# Altium schematic sheet MCU.SchDoc: MCU
size A3; Organization: ORGANIZATION; Address1: ADDRESS 1; Address2: ADDRESS 2; Address3: ADDRESS 3; Address4: ADDRESS 4; Revision: 0.0; SheetNumber: 4; SheetTotal: 19; ENG_APP_DATE: --/--/--; DSN_APP_DATE: --/--/--; CHK_APP_DATE: --/--/--
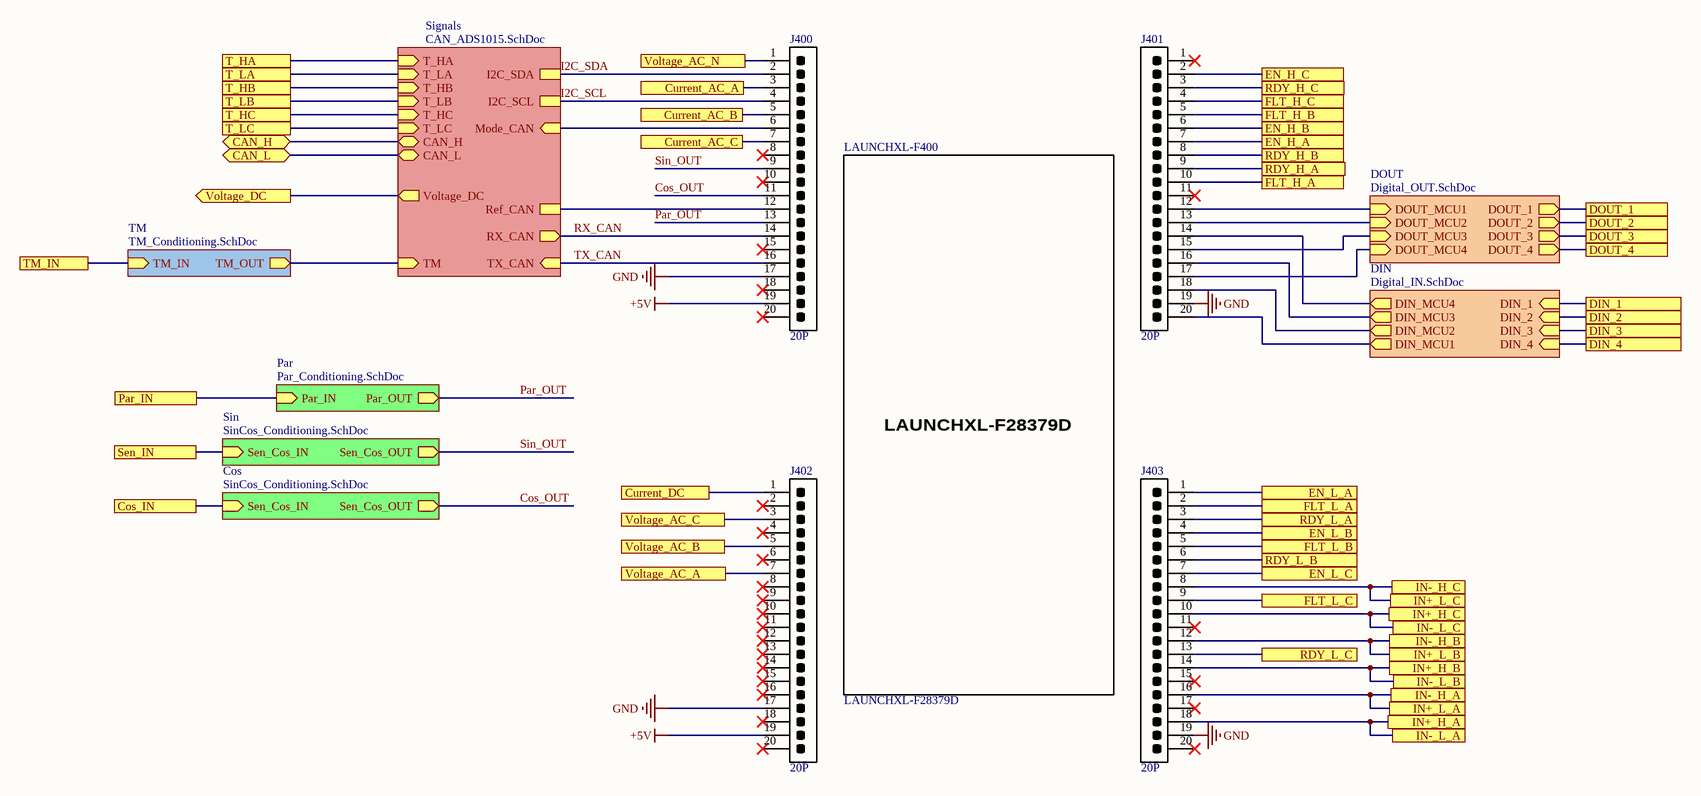
[diagram p0: MCU.SchDoc]

## Parts
J400  value 20P  [PIN_HEADER_THT_20P]  (hidden comment: CONN 20P)
J401  value 20P  [PIN_HEADER_THT_20P]  (hidden comment: CONN 20P)
J402  value 20P  [PIN_HEADER_THT_20P]  (hidden comment: CONN 20P)
J403  value 20P  [PIN_HEADER_THT_20P]  (hidden comment: CONN 20P)
LAUNCHXL-F400  LAUNCHXL-F28379D  [LAUNCHXL-F28379D]

## Sub-sheets
Cos = SinCos_Conditioning.SchDoc: Sen_Cos_OUT (out), Sen_Cos_IN (in)
DIN = Digital_IN.SchDoc: DIN_MCU1 (out), DIN_1 (in), DIN_MCU2 (out), DIN_MCU3 (out), DIN_MCU4 (out), DIN_2 (in), DIN_3 (in), DIN_4 (in)
DOUT = Digital_OUT.SchDoc: DOUT_MCU1 (in), DOUT_1 (out), DOUT_MCU2 (in), DOUT_MCU3 (in), DOUT_MCU4 (in), DOUT_2 (out), DOUT_3 (out), DOUT_4 (out)
Par = Par_Conditioning.SchDoc: Par_OUT (out), Par_IN (in)
Signals = CAN_ADS1015.SchDoc: T_LB (in), CAN_H (bidir), CAN_L (bidir), T_HB (in), TM (in), T_LA (in), T_LC (in), T_HA (in), T_HC (in), RX_CAN (out), TX_CAN (in), Ref_CAN, Mode_CAN (in), I2C_SDA, I2C_SCL, Voltage_DC (out)
Sin = SinCos_Conditioning.SchDoc: Sen_Cos_OUT (out), Sen_Cos_IN (in)
TM = TM_Conditioning.SchDoc: TM_IN (in), TM_OUT (out)

## Ports
CAN_H (bidir), CAN_L (bidir), Cos_IN, Current_AC_A, Current_AC_B, Current_AC_C, Current_DC, DIN_1, DIN_2, DIN_3, DIN_4, DOUT_1, DOUT_2, DOUT_3, DOUT_4, EN_H_A, EN_H_B, EN_H_C, EN_L_A, EN_L_B, EN_L_C, FLT_H_A, FLT_H_B, FLT_H_C, FLT_L_A, FLT_L_B, FLT_L_C, IN+_H_A, IN+_H_B, IN+_H_C, IN+_L_A, IN+_L_B, IN+_L_C, IN-_H_A, IN-_H_B, IN-_H_C, IN-_L_A, IN-_L_B, IN-_L_C, Par_IN, RDY_H_A, RDY_H_B, RDY_H_C, RDY_L_A, RDY_L_B, RDY_L_C, Sen_IN, T_HA, T_HB, T_HC, T_LA, T_LB, T_LC, TM_IN, Voltage_AC_A, Voltage_AC_B, Voltage_AC_C, Voltage_AC_N, Voltage_DC (out)

## Nets
+5V: J400.19 J402.19
GND: J400.17 J401.19 J402.17 J403.19
CAN_H: port CAN_H, sheet Signals/CAN_H
CAN_L: port CAN_L, sheet Signals/CAN_L
Cos_IN: port Cos_IN, sheet Cos/Sen_Cos_IN
Cos_OUT: J400.11 ; sheet Cos/Sen_Cos_OUT
Current_AC_A: J400.3 ; port Current_AC_A
Current_AC_B: J400.5 ; port Current_AC_B
Current_AC_C: J400.7 ; port Current_AC_C
Current_DC: J402.1 ; port Current_DC
DIN_1: port DIN_1, sheet DIN/DIN_1
DIN_2: port DIN_2, sheet DIN/DIN_2
DIN_3: port DIN_3, sheet DIN/DIN_3
DIN_4: port DIN_4, sheet DIN/DIN_4
DOUT_1: port DOUT_1, sheet DOUT/DOUT_1
DOUT_2: port DOUT_2, sheet DOUT/DOUT_2
DOUT_3: port DOUT_3, sheet DOUT/DOUT_3
DOUT_4: port DOUT_4, sheet DOUT/DOUT_4
EN_H_A: J401.7 ; port EN_H_A
EN_H_B: J401.6 ; port EN_H_B
EN_H_C: J401.2 ; port EN_H_C
EN_L_A: J403.1 ; port EN_L_A
EN_L_B: J403.4 ; port EN_L_B
EN_L_C: J403.7 ; port EN_L_C
FLT_H_A: J401.10 ; port FLT_H_A
FLT_H_B: J401.5 ; port FLT_H_B
FLT_H_C: J401.4 ; port FLT_H_C
FLT_L_A: J403.2 ; port FLT_L_A
FLT_L_B: J403.5 ; port FLT_L_B
FLT_L_C: J403.9 ; port FLT_L_C
I2C_SCL: J400.4 ; sheet Signals/I2C_SCL
I2C_SDA: J400.2 ; sheet Signals/I2C_SDA
IN+_H_A: J403.18 ; port IN+_H_A, port IN-_L_A
IN+_H_B: J403.14 ; port IN+_H_B, port IN-_L_B
IN+_H_C: J403.10 ; port IN+_H_C, port IN-_L_C
IN+_L_A: J403.16 ; port IN-_H_A, port IN+_L_A
IN+_L_B: J403.12 ; port IN-_H_B, port IN+_L_B
IN+_L_C: J403.8 ; port IN-_H_C, port IN+_L_C
Par_IN: port Par_IN, sheet Par/Par_IN
Par_OUT: J400.13 ; sheet Par/Par_OUT
RDY_H_A: J401.9 ; port RDY_H_A
RDY_H_B: J401.8 ; port RDY_H_B
RDY_H_C: J401.3 ; port RDY_H_C
RDY_L_A: J403.3 ; port RDY_L_A
RDY_L_B: J403.6 ; port RDY_L_B
RDY_L_C: J403.13 ; port RDY_L_C
RX_CAN: J400.14 ; sheet Signals/RX_CAN
Sen_IN: port Sen_IN, sheet Sin/Sen_Cos_IN
Sin_OUT: J400.9 ; sheet Sin/Sen_Cos_OUT
T_HA: port T_HA, sheet Signals/T_HA
T_HB: port T_HB, sheet Signals/T_HB
T_HC: port T_HC, sheet Signals/T_HC
T_LA: port T_LA, sheet Signals/T_LA
T_LB: port T_LB, sheet Signals/T_LB
T_LC: port T_LC, sheet Signals/T_LC
TM_IN: port TM_IN, sheet TM/TM_IN
TX_CAN: J400.16 ; sheet Signals/TX_CAN
Voltage_AC_A: J402.7 ; port Voltage_AC_A
Voltage_AC_B: J402.5 ; port Voltage_AC_B
Voltage_AC_C: J402.3 ; port Voltage_AC_C
Voltage_AC_N: J400.1 ; port Voltage_AC_N
Voltage_DC: port Voltage_DC, sheet Signals/Voltage_DC
NetJ400_6: J400.6 ; sheet Signals/Mode_CAN
NetJ400_12: J400.12 ; sheet Signals/Ref_CAN
NetJ401_12: J401.12 ; sheet DOUT/DOUT_MCU1
NetJ401_13: J401.13 ; sheet DOUT/DOUT_MCU2
NetJ401_14: J401.14 ; sheet DIN/DIN_MCU4
NetJ401_15: J401.15 ; sheet DOUT/DOUT_MCU3
NetJ401_16: J401.16 ; sheet DIN/DIN_MCU3
NetJ401_17: J401.17 ; sheet DOUT/DOUT_MCU4
NetJ401_18: J401.18 ; sheet DIN/DIN_MCU2
NetJ401_20: J401.20 ; sheet DIN/DIN_MCU1
(unnamed): sheet Signals/TM, sheet TM/TM_OUT

Not connected (* = marked no-connect by the designer): J400 8* 10* 15* 18* 20*; J401 1* 11*; J402 2* 4* 6* 8* 9* 10* 11* 12* 13* 14* 15* 16* 18* 20*; J403 11* 15* 17* 20*

## Notes on the sheet
- Project:
- Subsystem:
- Company:
- Document:
- Author:
- Revision:
- Date:
- Sheet:
- /

## Library data of the parts
J400-J403 = 110-0062: Alojamientos de cables y cabecera 2.54mm Male Header, 2X20pin, Straight, PA6T, Gold Flash; MPN: SSK03-MPH-254-B10; Manufacturer: Same Sky; ComponentLink1Description: Datasheet; ComponentLink1URL: https://www.mouser.es/datasheet/3/6118/1/ssk03_mph_254.pdf; ComponentLink2Description: Distributor Link; ComponentLink2URL: https://www.mouser.es/ProductDetail/Same-Sky/SSK03-MPH-254-B10?qs=G4MbTVxgV4GMuEeZX4ESdA%3D%3D; ID: 110-0062; Package: THT 2,54mm; Distributor PN: 179-SSK03MPH254B10; Distributor: Mouser
LAUNCHXL-F400 = 090-0002: Equipos y placas de desarrollo - TMS320 C2000 F28379D DELFIN O LAUNCHPAD; Manufacturer: Texas Instruments; ComponentLink1Description: Datasheet; ComponentLink1URL: https://www.ti.com/lit/ug/sprui77c/sprui77c.pdf?ts=1639427205104&ref_url=https%253A%252F%252Fwww.google.com%252F; ComponentLink2Description: Distributor Link; ComponentLink2URL: https://www.mouser.es/ProductDetail/Texas-Instruments/LAUNCHXL-F28379D?qs=8%252Br4Hz5Xir%252BwQNYYjOfeVA%3D%3D; ID: 090-0002; Value: -; Package: -; MPN: LAUNCHXL-F28379D; Distributor PN: 595-LAUNCHXL-F28379D; Part: -; Distributor: Mouser